# EAGLE design KBV2R5 (EAGLE 5.09)
DIGIKEY#: PS1240P02CT3; MOUSER#: 81-GRM426X104K50D; NEWARK#: 89H0684

## Sheet 1 of 2
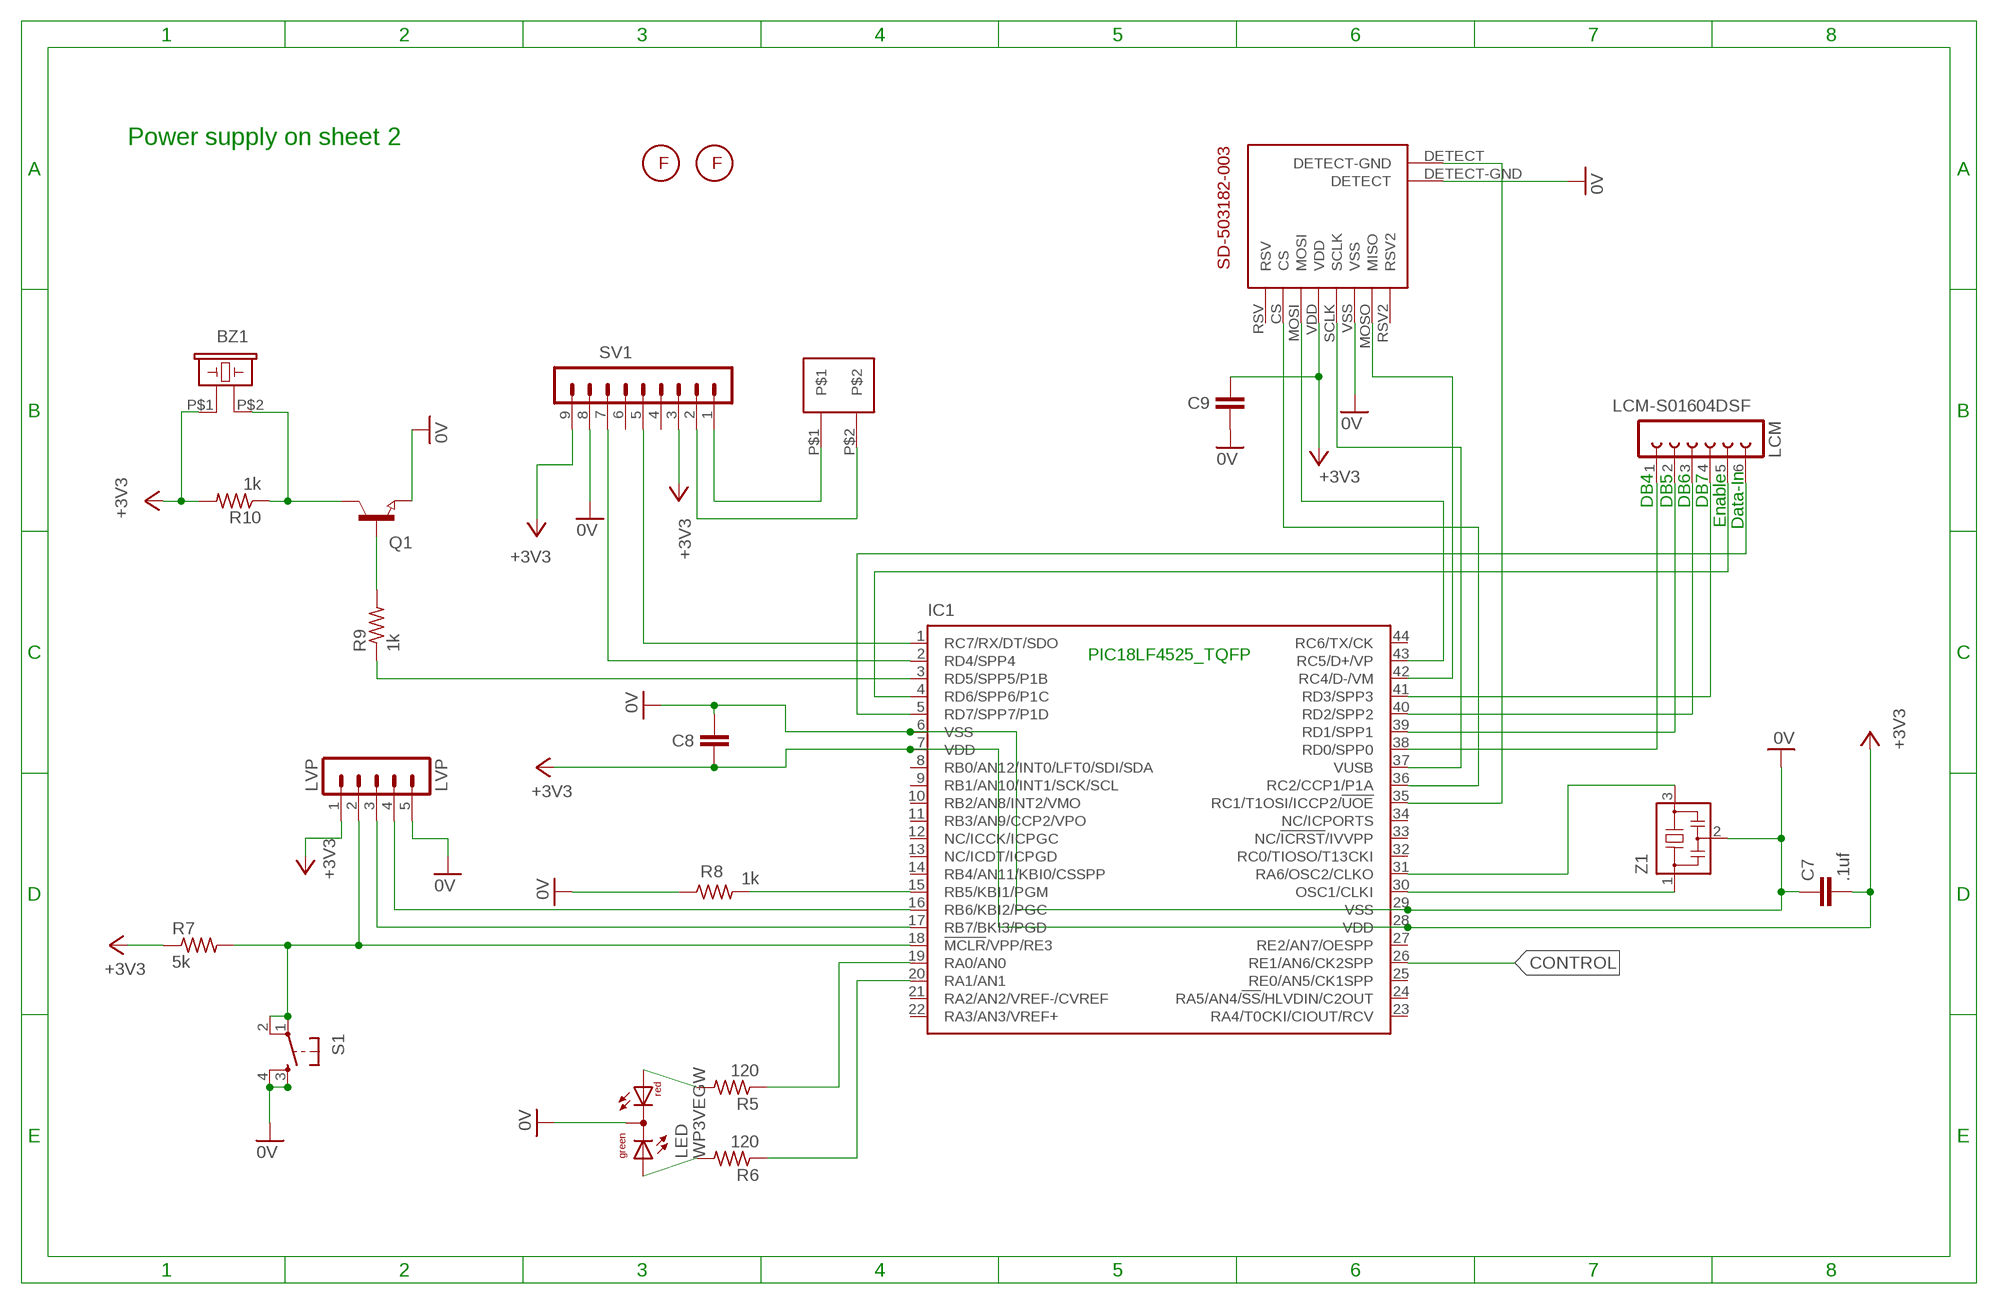
[diagram p0: schematic, sheet 1]

### Parts
BZ1  PS1240P02CT3  HP1360A  [HP1360A]
C7  .1uf  C-EUC1206  [C1206]
C8  .1 uf  C-EUC1206  [C1206]
C9  .1uf  C-EUC1206  [C1206]
FM1  FIDUCIAL2MMCIRCLE  [FIDUCIAL_2MMCIRCLE]
FM2  FIDUCIAL2MMCIRCLE  [FIDUCIAL_2MMCIRCLE]
IC1  PIC18F4525_TQFP Newark 89H0684  PIC18F4550_TQFP  [TQFP44]
LCM  LCM-S01604DSF  FE06-1  [FE06]
LED  WP3VEGW  [DUOLED-A-3MM]
LVP  LVP  MA05-1  [MA05-1]
P1  RC1  2PINPAD  [2PINPAD]
Q1  NPN-TRANSISTOR_SOT23  [SOT23]
R5  120  R-US_R0805W  [R0805W]
R6  120  R-US_R0805W  [R0805W]
R7  5k  R-US_R0805W  [R0805W]
R8  1k  R-US_R0805W  [R0805W]
R9  1k  R-US_R0805W  [R0805W]
R10  1k  R-US_R0805W  [R0805W]
S1  DTS-6  [DTS-6]
SD1  SD-503182-003R  [SD-503182-003]
SV1  MA09-1  [MA09-1]
Z1  CSTCR4M00G53-R0  CSTCR6M00G53Z  [CSTCR6M]

### Nets
0V [GND]: C7.1 C8.1 C9.2 IC1.6(VSS) IC1.29(VSS) LED.2(C) LVP.5 Q1.2(E) R8.1 S1.3 S1.4 SD1.DETECT-GND(DETECT) SD1.VSS SV1.8 Z1.2 ; also sheet 2
+3V3: BZ1.P$1 C7.2 C8.2 C9.1 IC1.7(VDD) IC1.28(VDD) LVP.1 R7.1 R10.2 SD1.VDD SV1.3 SV1.9 ; also sheet 2
CONTROL: IC1.26(RE1/AN6/CK2SPP) ; also sheet 2
N$1: IC1.5(RD7/SPP7/P1D) LCM.6
N$2: IC1.42(RC4/D-/VM) SD1.MOSO(MISO)
N$3: IC1.30(OSC1/CLKI) Z1.1
N$4: Q1.1(B) R9.2
N$5: P1.P$2 SV1.2
N$6: P1.P$1 SV1.1
N$7: IC1.3(RD5/SPP5/P1B) R9.1
N$8: BZ1.P$2 Q1.3(C) R10.1
N$9: IC1.36(RC2/CCP1/P1A) SD1.CS
N$10: IC1.19(RA0/AN0) R5.1
N$11: IC1.20(RA1/AN1) R6.1
N$12: IC1.37(VUSB) SD1.SCLK
N$14: IC1.15(RB5/KBI1/PGM) R8.2
N$15: IC1.17(RB7/BKI3/PGD) LVP.3
N$17: IC1.18(!MCLR!/VPP/RE3) LVP.2 R7.2 S1.1 S1.2
N$18: IC1.16(RB6/KBI2/PGC) LVP.4
N$19: IC1.31(RA6/OSC2/CLKO) Z1.3
N$20: IC1.1(RC7/RX/DT/SDO) SV1.5
N$21: IC1.2(RD4/SPP4) SV1.7
N$24: LED.3(AG) R6.2
N$25: LED.1(AR) R5.2
N$26: IC1.35(RC1/T1OSI/ICCP2/!UOE) SD1.DETECT(DETECT-GND)
N$29: IC1.43(RC5/D+/VP) SD1.MOSI
N$30: IC1.4(RD6/SPP6/P1C) LCM.5
N$31: IC1.38(RD0/SPP0) LCM.1
N$32: IC1.39(RD1/SPP1) LCM.2
N$33: IC1.40(RD2/SPP2) LCM.3
N$34: IC1.41(RD3/SPP3) LCM.4
Unconnected: IC1.8(RB0/AN12/INT0/LFT0/SDI/SDA) IC1.9(RB1/AN10/INT1/SCK/SCL) IC1.10(RB2/AN8/INT2/VMO) IC1.11(RB3/AN9/CCP2/VPO) IC1.12(NC/ICCK/ICPGC) IC1.13(NC/ICDT/ICPGD) IC1.14(RB4/AN11/KBI0/CSSPP) IC1.21(RA2/AN2/VREF-/CVREF) IC1.22(RA3/AN3/VREF+) IC1.23(RA4/T0CKI/CIOUT/RCV) IC1.24(RA5/AN4/!SS!/HLVDIN/C2OUT) IC1.25(RE0/AN5/CK1SPP) IC1.27(RE2/AN7/OESPP) IC1.32(RC0/TIOSO/T13CKI) IC1.33(NC/!ICRST!/IVVPP) IC1.34(NC/ICPORTS) IC1.44(RC6/TX/CK) SD1.RSV SD1.RSV2 SV1.4 SV1.6

### Notes on the sheet
- Power supply on sheet 2
- DB4 | DB5 | DB6 | DB7
- Enable | Data-In
- PIC18LF4525_TQFP

## Sheet 2 of 2
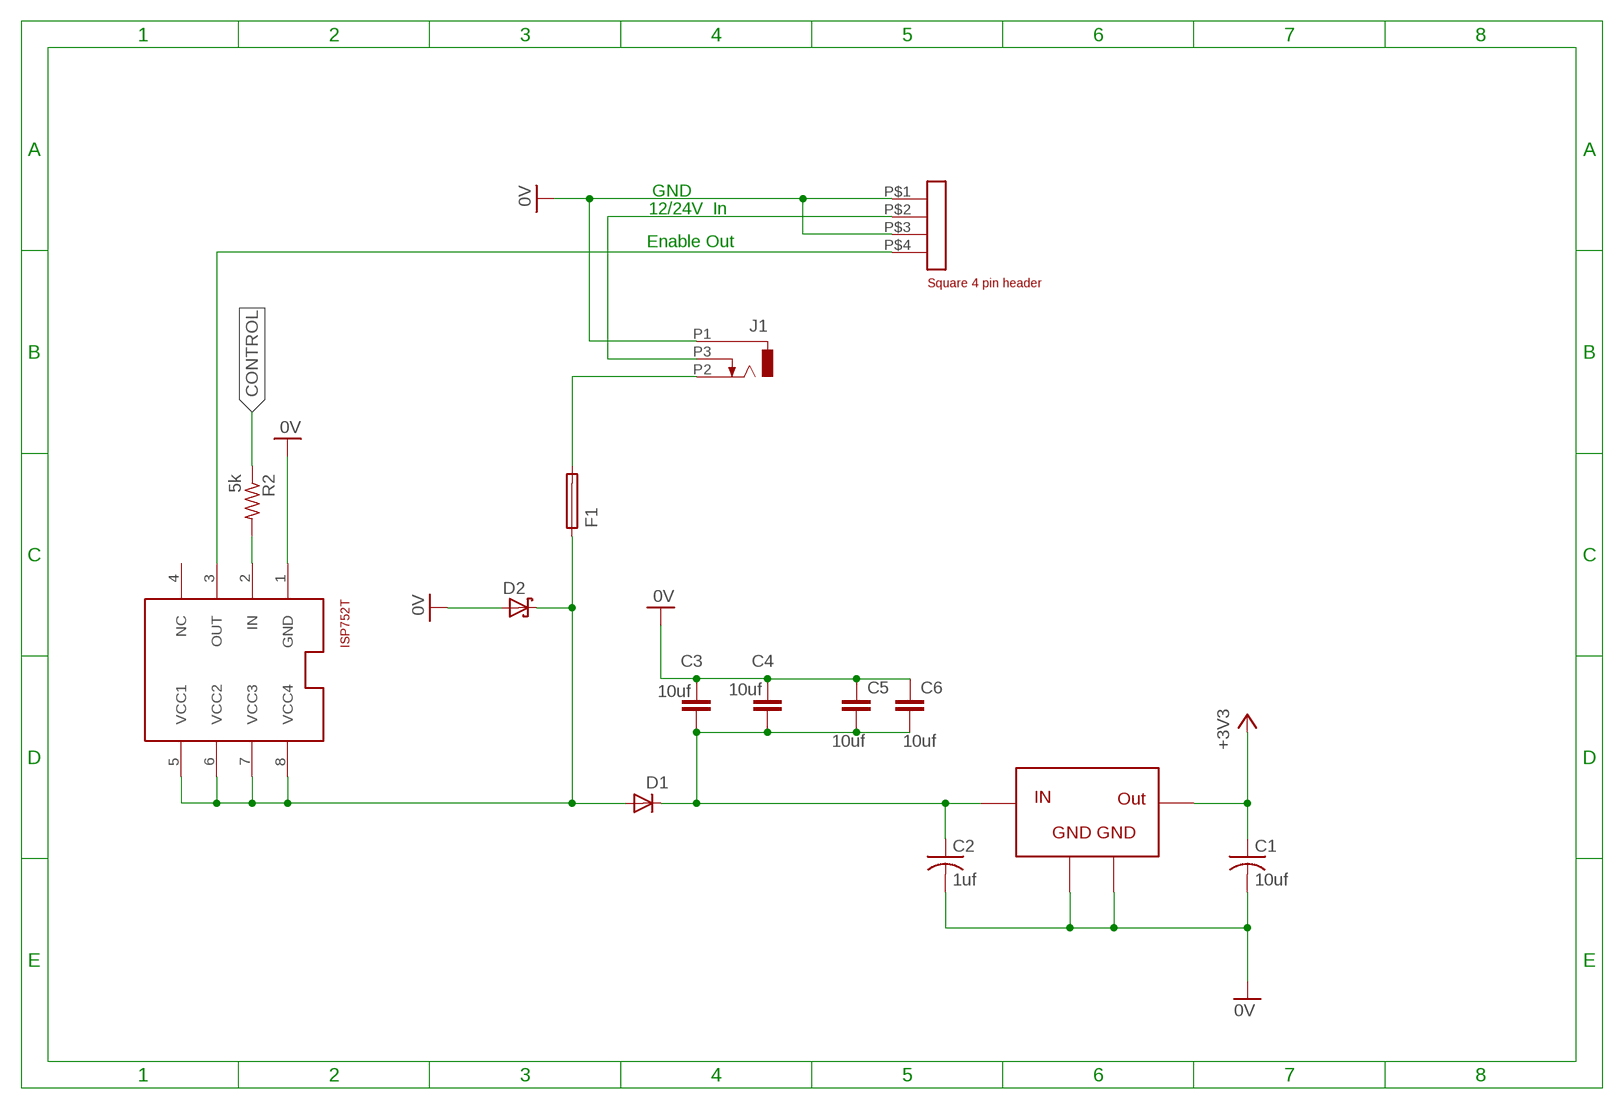
[diagram p1: schematic, sheet 2]

### Parts
C1  10uf  C-USC1210  [C1210]
C2  1uf  C-USC1206  [C1206]
C3  10uf  CAP_CKG57NX5R1H226M  [CKG57]
C4  10uf  CAP_CKG57NX5R1H226M  [CKG57]
C5  10uf  C-EUC1210  [C1210]
C6  10uf  C-EUC1210  [C1210]
D1  M 522-ZHCS400TA  DIODE-SOD323-W  [SOD323-W]
D2  M 863-1SMC28AT3G  SCHOTTKY-DIODESMD  [SMB]
F1  60R090X  72R090X  [LITTLEFUSE]
J1  CP1-022PJCT-ND  [CP1-022PJCT-ND]
J2  MOUSER538-43045-0424  MOUSER538-43045-0224  [MOUSER538-43045-0224]
R2  5k  R-US_R0805W  [R0805W]
SW1  ISP752T  [SO8]
VR1  NCV4274  [NCV4274]

### Nets
0V [GND]: C1.2 C2.2 C3.P$1 C4.P$1 C5.1 C6.1 D2.A J1.P1 J2.P$1 J2.P$3 SW1.1(GND) VR1.P$2 VR1.P$4 ; also sheet 1
+3V3: C1.1 VR1.P$3 ; also sheet 1
CONTROL: R2.1 ; also sheet 1
N$13: R2.2 SW1.2(IN)
N$16: J2.P$4 SW1.3(OUT)
N$22: J1.P3 J2.P$2
N$23: F1.2 J1.P2
N$27: C2.1 C3.P$2 C4.P$2 C5.2 C6.2 D1.C VR1.P$1
N$28: D1.A D2.C F1.1 SW1.5(VCC1) SW1.6(VCC2) SW1.7(VCC3) SW1.8(VCC4)
Unconnected: SW1.4(NC)

### Notes on the sheet
- GND
- 12/24V  In
- Enable Out

## Library data of the parts
BZ1 = buzzer:HP1360A: HP1360A Piezo Buzzer
C1 C2 = rcl:C-US: CAPACITOR, American symbol
C3 C4 = capacitor-wima:CAP_CKG57NX5R1H226M: Multilayer Ceramic Capacitors (MLCC)
C5 C6 = rcl:C-EU: CAPACITOR, European symbol
C7-C9 = resistor:C-EU: CAPACITOR, European symbol
D1 = diode:DIODE-: DIODE
D2 = diode:SCHOTTKY-DIODE: Schottky Diode
F1 = fuse:72R090X: Newark 33P9991 Resettable Fuse .8 amp holding 1.8 amp trip
FM1 FM2 = pickplace:FIDUCIAL: Fiducial marks
IC1 = microchip:PIC18F4*_TQFP: USB Microcontrollers with nanoWatt Technology High-Performance, Enhanced Flash, 28/40/44-Pin, Source: http://ww1.microchip.com/downloads/en/devicedoc/39632c.pdf
J1 = con-jack:CP1-022PJCT-ND: Digikey SMT right angle power jack P1-022PJCT-ND
J2 = Keybuster:MOUSER538-43045-0224: Mouser 2 row 4pin header (2x2)
LCM = con-lsta:FE06-1: FEMALE HEADER
LED = led:WP3VEGW: Red-Green dual LED
LVP = con-lstb:MA05-1: PIN HEADER
P1 = Misc:2PINPAD
Q1 = semicon-smd-ipc:NPN-TRANSISTOR_: NPN TRANSISTOR
R2 R5-R7 R9 R10 = rcl:R-US_: RESISTOR, American symbol
R8 = resistor:R-US_: RESISTOR, American symbol
S1 = switch-tact:DTS-6
SD1 = MolexSD:SD-503182-003R: Molex Micro-SD card socket
SV1 = con-lstb:MA09-1: PIN HEADER
SW1 = zetex:ISP752T: High side switch
VR1 = Keybuster:NCV4274: Precision micro-power voltage regulator
Z1 = murata-filter:CSTCR: Resonator Source: murata.co.jp

## Net classes
0 default: width 0.203 mm
1 GND: width 0.635 mm

## Board
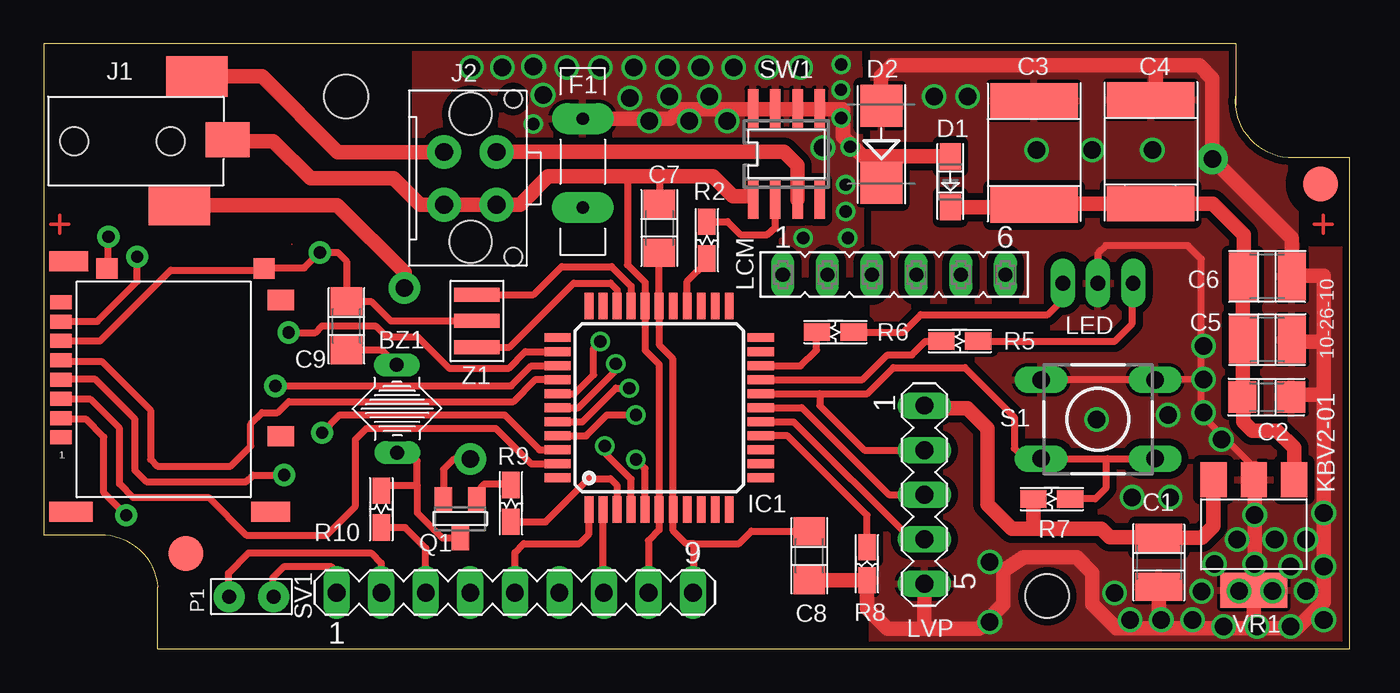
[diagram p2: board, top side]
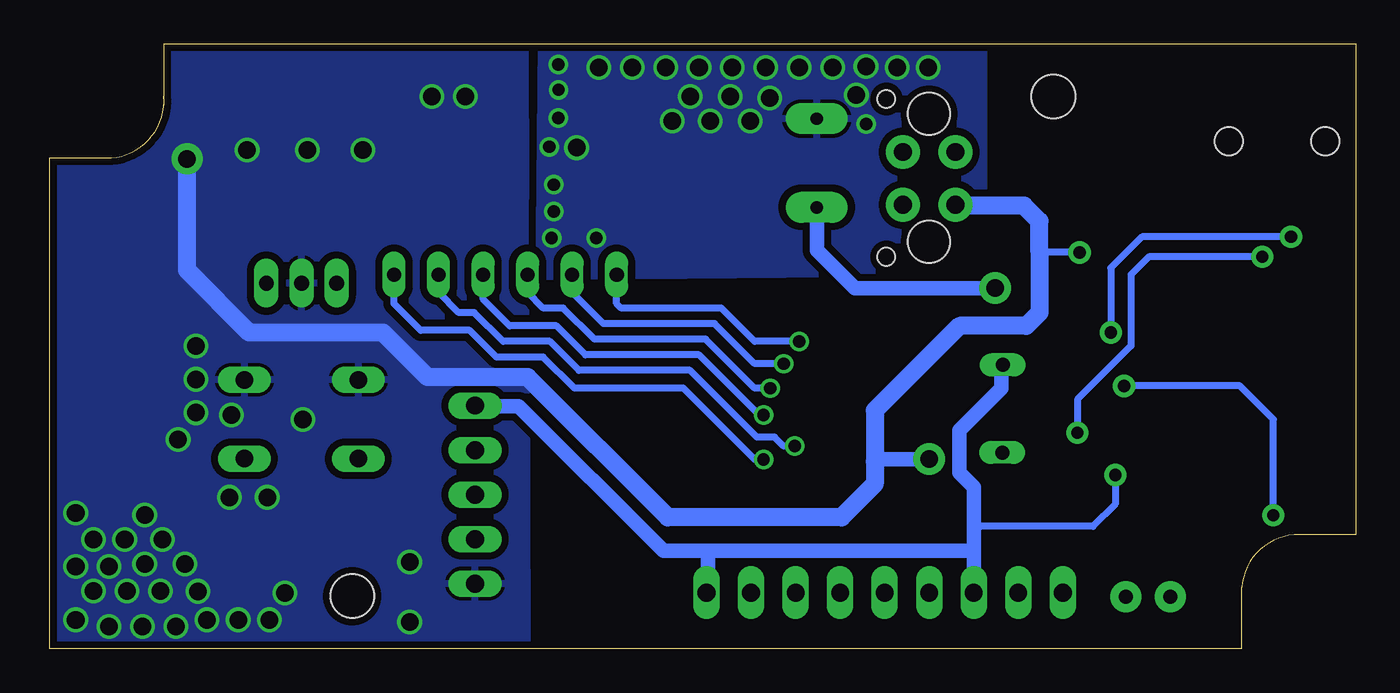
[diagram p3: board, bottom side, seen from below]

Size 74.5 x 34.5 mm. Coordinates in mm from the lower left corner, seen from the top.
Copper layers (1*16): Top 0.035mm / dielectric 1.5mm / Bottom 0.035mm
Design rules "default *": minimum track width 12mil, minimum drill 24mil, track to track 8mil, track to pad 8mil, pad to pad 8mil, via to via 8mil, smd to smd 8mil, copper to edge 8mil, drill to drill 8mil, minimum pad ring 10mil, minimum via ring 8mil, stop-mask expansion 4mil, vias tented up to drill 0mil, thermal gap 8mil
tRestrict: area 72,23.4 to 73.9,25

### Footprints (pad centres in the part's own frame; a part is rotated, then mirrored left to right if it is on the bottom)
HP1360A = drill 0.8 long: P$1 -2.5,0; P$2 2.5,0
C1210 = smd 1.6 x 2.7: 1 -1.4,0; 2 1.4,0
C1206 = smd 1.6 x 1.8: 1 -1.4,0; 2 1.4,0
CKG57 = smd 2 x 5: P$1 1,-2.5; P$2 6.95,-2.5
SOD323-W = smd 1.5 x 1.2: A 1.45,0; C -1.45,0
SMB = smd 2.4 x 2.4: A 2.2,0; C -2.2,0
LITTLEFUSE = drill 0.7 pad 1.778 long: 1 -5.056,0; 2 0.004,0
FIDUCIAL_2MMCIRCLE = smd 2 x 2: P$1 0,0
TQFP44 = smd 1.5 x 0.5: 1 -5.8,4; 2 -5.8,3.2; 3 -5.8,2.4; 4 -5.8,1.6; 5 -5.8,0.8; 6 -5.8,0; 7 -5.8,-0.8; 8 -5.8,-1.6; 9 -5.8,-2.4; 10 -5.8,-3.2; 11 -5.8,-4; 23 5.8,-4; 24 5.8,-3.2; 25 5.8,-2.4; 26 5.8,-1.6; 27 5.8,-0.8; 28 5.8,0; 29 5.8,0.8; 30 5.8,1.6; 31 5.8,2.4; 32 5.8,3.2; 33 5.8,4 | smd 0.5 x 1.5: 12 -4,-5.8; 13 -3.2,-5.8; 14 -2.4,-5.8; 15 -1.6,-5.8; 16 -0.8,-5.8; 17 0,-5.8; 18 0.8,-5.8; 19 1.6,-5.8; 20 2.4,-5.8; 21 3.2,-5.8; 22 4,-5.8; 34 4,5.8; 35 3.2,5.8; 36 2.4,5.8; 37 1.6,5.8; 38 0.8,5.8; 39 0,5.8; 40 -0.8,5.8; 41 -1.6,5.8; 42 -2.4,5.8; 43 -3.2,5.8; 44 -4,5.8
CP1-022PJCT-ND = smd 2.5 x 2: P1 2.76,4.84 | smd 3.5 x 2.3: P2 0.01,1.11; P3 1.01,8.46 | hole 1.6: -0.49,4.76; -5.99,4.76
MOUSER538-43045-0224 = drill 1.02 pad 1.93 round: P$1 0,0; P$2 -3,0; P$3 0,3; P$4 -3,3 | hole 2.41: 2.13,1.5; -5.17,1.5 | hole 1.02: -6.02,3.94; 2.97,3.94
FE06 = drill 0.813 long: 1 -6.35,0; 2 -3.81,0; 3 -1.27,0; 4 1.27,0; 5 3.81,0; 6 6.35,0
DUOLED-A-3MM = drill 0.85 pad 1.4 long: 1 -2,0; 2 0,0; 3 2,0
MA05-1 = drill 1.016 long: 1 -5.08,0; 2 -2.54,0; 3 0,0; 4 2.54,0; 5 5.08,0
2PINPAD = drill 0.8 pad 1.778 round: P$1 0,0; P$2 2.54,0
SOT23 = smd 1 x 1.4: 1 -0.95,-1.1; 2 0.95,-1.1; 3 0,1.1
R0805W = smd 1.5 x 1: 1 -1.052,0; 2 1.052,0
R0805W' = smd 1.5 x 1: 1 -0.94,0; 2 0.94,0
DTS-6 = drill 1 long: 1 -3.25,2.25; 2 3.25,2.25; 3 -3.25,-2.25; 4 3.25,-2.25
SD-503182-003 = smd 1.24 x 0.8: CS -13.11,5.97; MOSI -13.11,7.07; MOSO -13.11,11.47; RSV -13.11,4.87; RSV2 -13.11,12.57; SCLK -13.11,9.27; VDD -13.11,8.17; VSS -13.11,10.37 | smd 1.25 x 1.16: DETECT -10.48,14.51 | smd 1.2 x 1.16: DETECT-GND -1.52,14.51 | smd 1.5 x 1.15: NC1 -0.55,12.71; NC2 -0.56,4.93 | smd 2.2 x 1.15: NC3 -1.14,0.63; NC5 -12.66,14.91 | smd 2.5 x 1.15: NC4 -12.53,0.63
MA09-1 = drill 1.016 long: 1 -10.16,0; 2 -7.62,0; 3 -5.08,0; 4 -2.54,0; 5 0,0; 6 2.54,0; 7 5.08,0; 8 7.62,0; 9 10.16,0
SO8 = smd 0.6 x 2.2: 1 -1.905,-2.6; 2 -0.635,-2.6; 3 0.635,-2.6; 4 1.905,-2.6; 5 1.905,2.6; 6 0.635,2.6; 7 -0.635,2.6; 8 -1.905,2.6
KBV2 = hole 2.5: 17.25,31.5; 57.25,3
NCV4274 = smd 1.5 x 2: P$1 -2.3,-6.3; P$2 0,-6.3; P$3 2.3,-6.3 | smd 3.8 x 2: P$4 0,-0.02
CSTCR6M = smd 0.8 x 2.6: 1 -1.5,0; 2 0,0; 3 1.5,0

### Placement (x,y rotation side)
BZ1  20.15,13.69 270.3 top
C1  63.61,4.94 270 top
C2  69.77,14.36 0 top
C3  58.99,32.26 270 top
C4  65.65,32.32 270 top
C5  69.8,17.63 180 top
C6  69.8,21.23 180 top
C7  35.12,23.99 270 top
C8  43.68,5.31 90 top
C9  17.27,18.41 90 top
D1  51.73,26.63 90 top
D2  47.78,28.77 90 top
F1  30.75,25.17 270 top
FM1  8.1,5.44 0 top
FM2  72.85,26.52 0 top
IC1  35.11,13.75 90 top
J1  7.72,24.18 0 top
J2  22.84,25.33 270 top
LCM  48.51,21.34 0 top
LED  60.15,20.85 180 top
LVP  50.24,8.79 270 top
P1  13.11,2.97 180 top
Q1  23.76,7.42 180 top
R2  37.83,23.3 90 top
R5  52.26,17.55 0 top
R6  45.16,18.06 0 top
R7  57.51,8.55 0 top
R8  1k  [R0805W']  46.97,4.84 90 top
R9  26.65,8.29 90 top
R10  19.25,7.96 270 top
S1  60.15,13.09 180 top
SD1  14.08,7.18 0 top
SV1  26.87,3.2 0 top
SW1  42.37,28.22 0 top
U$1  [KBV2]  0,0 0 top
U$2  [CROSSHAIR_8MIL]  0.91,24.21 0 top
U$3  [CROSSHAIR_8MIL]  73,24.21 0 top
VR1  69.04,3.33 180 top
Z1  24.71,18.69 270 top

### Tracks (layer width: path | path; a pad name or v marks a point on that pad's centre or on a via)
0V  (via drill 0.7 pad 1.27, 1, 1 pad 1.78)
  Top 0.254: S1.3
  Top 0.305: IC1.6 35.11,7.92 | VR1.P$2 68.91,9.75 | 40.17,25.81 40.27,25.81 SW1.1
  Top 0.406: IC1.29 | IC1.29 34.3,19.58 34.3,20.89 33.29,21.89 33.29,26.88 33.35,26.95 | 34.49,26.95 34.48,26.94 | IC1.29 34.3,17.02 35.1,16.22 IC1.6 | 34.87,26.95 34.86,26.94 | 35.11,7.92 35.11,6.78 34.49,6.17 SV1.8 | C7.1 35.12,26.83 35,26.95 | C2.2 71.2,14.38 | 1,17.53 SD1.VSS 3.2,17.55 7.24,21.59 12.41,21.59 SD1.DETECT-GND | SD1.DETECT-GND 12.33,21.67 | SD1.DETECT-GND 12.58,21.72 14.86,21.72 v15.75,22.61 16.76,22.61 17.27,22.1 C9.2 | SD1.DETECT-GND 12.33,21.46 | 63.35,15.34 S1.4 | Z1.2 19.79,18.69 18.67,19.81 C9.2 | 16.76,19.81 16.64,19.94 17.15,19.94 C9.2 | LED.2 60.15,22.55 60.58,22.99 65.28,22.99 66.04,22.23 66.04,15.37 | 66.04,15.37 66.04,13.34 69.09,10.29 69.09,9.68 VR1.P$2 | 63.35,15.34 S1.3 | 66.04,15.37 63.35,15.34 | Q1.2 22.8,10.23 23.37,10.79 24.31,10.79 v24.33,10.82
  Top 0.813: 40.17,25.81 39.32,25.81 38.18,26.95 35,26.95 34.87,26.95 34.49,26.95 33.35,26.95 28.78,26.95 27.16,25.33 J2.P$3 J2.P$1 | 69.04,1.17 VR1.P$4 69.09,3.4 69.09,10.29 | C2.2 71.17,14.86 71.56,14.48 73.03,14.48 | C4.P$1 63.45,31.62 63.45,33.2 63.37,33.27 | C3.P$1 56.41,31.34 | J1.P1 10.55,28.96 13.08,28.96 15.21,26.82 19.97,26.82 21.46,25.33 J2.P$1 | 73.03,14.48 73.03,2.69 71.53,1.19 71.42,1.17 69.04,1.17 | 73.03,17.5 73.03,14.48 | 73.03,17.5 73.03,21.26 71.22,21.26 C6.1 | C5.1 71.33,17.5 73.03,17.5 | C6.1 71.12,21.31 | 69.04,1.17 63.75,1.17 | C1.2 63.61,1.31 63.75,1.17 | J2.P$1 | LVP.5 50.24,1.19 50.29,1.14 | 50.29,1.14 48.13,1.14 46.97,2.31 R8.1 C8.1 | 50.29,1.14 53.34,1.14 54.74,2.54 54.74,4.45 55.88,5.21 58.93,5.21 59.82,4.32 59.82,2.54 61.19,1.17 63.75,1.17 | 63.37,33.27 48.39,33.27 47.75,32.64 47.75,31 D2.A | C6.1 71.2,23.42 v66.67,27.94 66.67,32.51 65.91,33.27 63.37,33.27
  Bottom 0.406: v24.33,10.82 24.26,10.9 | v15.75,22.61 18.03,22.61
  Bottom 0.813: 24.38,10.87 v24.33,10.82 27.28,10.82 27.3,10.79 | 22.78,25.27 J2.P$1
  Bottom 1.016: 22.78,25.27 18.92,25.27 18.03,24.38 18.03,22.61 18.03,19.18 18.8,18.41 22.61,18.41 27.43,13.59 27.43,10.67 | v66.67,27.94 66.67,21.59 63.12,18.03 55.5,18.03 52.96,15.49 47.24,15.49 39.24,7.49 29.34,7.49 27.43,9.4 27.43,10.67 | 27.43,10.67 27.3,10.79
  other vias: 61.09,3.17 67.31,1.27 66.8,4.83 61.98,1.65 73.03,1.65 64.14,13.34 73.03,4.7 67.18,11.94 66.17,15.37 69.22,1.27 62.1,8.64 64.26,8.64 69.09,7.62 72.01,6.22 68.07,6.22 69.09,4.83 70.23,6.22 71.12,4.7 72.01,3.3 71.12,1.27 70.1,3.3 68.2,3.3 65.53,1.65 63.75,1.65 66.05,3.28 66.17,17.27 66.17,13.46 73.03,7.75 63.25,28.45 59.82,28.45 56.64,28.45 52.7,31.5 53.98,4.95 53.98,1.52 50.8,31.5 60.07,13.08
  pour Bottom (isolate 0.406, rank 4): 47.37,34.54 74.6,34.58 74.3,0.13 47.24,0.25
  pour Top (isolate 0.406, rank 4): 47.26,0.25 74.17,0.2 74.63,34.59 47.32,34.53
+3V3  (via drill 0.7 pad 1.27)
  Top 0.305: IC1.7 | 35.1,22.58 C7.2
  Top 0.406: IC1.7 35.89,7.96 35.89,16.54 35.13,17.3 35.13,19.52 IC1.28 35.1,22.58 | LVP.1 50.23,13.88 | R10.2 20.62,6.91 21.79,5.74 SV1.3 | IC1.7 35.89,7.93 | 63.6,6.35 C1.1 63.63,6.33 | 13.59,9.91 13.72,10.03 v13.72,9.91 11.94,9.91 11.56,9.53 5.84,9.53 5.21,10.16 5.21,13.08 2.92,15.37 0.98,15.37 SD1.VDD | C9.1 19.31,17.02 BZ1.P$1 | 37.08,5.99 36.65,5.99 35.91,6.74 IC1.7 | 37.08,5.99 39.65,5.99 40.36,6.71 C8.2 | SV1.9 37.08,3.25 37.08,5.99
  Top 0.508: LVP.1 50.25,13.88
  Top 0.813: VR1.P$3 66.74,7 66.24,6.5 66.23,6.5 66.06,6.33 63.63,6.33 62.47,6.33 | C1.1 63.6,6.35 60.83,6.35 60.33,6.86 56.52,6.86 | 56.52,6.86 55.24,6.86 53.85,8.26 53.85,12.57 52.7,13.72 50.39,13.72 LVP.1 | R7.1 56.45,6.92 56.52,6.86
  Bottom 0.406: v13.72,9.91 13.72,8.26 14.99,6.99 21.41,6.99 21.79,6.6
  Bottom 0.813: 21.79,5.59 SV1.3 | LVP.1 50.22,13.84 47.75,13.84 39.5,5.59 36.96,5.59 | 21.79,5.59 36.96,5.59 | SV1.9 36.96,3.28 36.96,5.59 | 21.79,5.59 21.79,6.6 21.79,9.22 22.61,10.03 22.61,12.46 20.21,14.86 20.21,16.12 BZ1.P$1
CONTROL
  Top 0.305: IC1.26
  Top 0.406: R2.1 37.83,22.08 36.7,20.95 IC1.26
N$1  (via drill 0.7)
  Top 0.406: IC1.5 34.3,10.27 v33.78,10.79
  Bottom 0.406: v33.78,10.79 34.29,10.79 38.35,14.86 44.58,14.86 46.35,16.64 49.02,16.64 50.55,18.16 53.34,18.16 54.86,19.68 LCM.6
N$2  (via drill 0.7 pad 1.27)
  Top 0.406: SD1.MOSO 0.99,18.67 3.05,18.67 5.33,20.95 v5.33,22.35 5.33,22.48 | IC1.42 28.28,11.35 26.29,13.34 16.89,13.34 v15.88,12.32
  Bottom 0.406: v5.33,22.35 11.81,22.35 12.83,21.34 12.83,17.27 15.88,14.22 v15.88,12.32
N$3
  Top 0.305: IC1.30
  Top 0.406: IC1.30 33.5,20.69 32.4,21.79 29.54,21.79 27.94,20.19 Z1.1
N$4
  Top 0.406: Q1.1 24.71,8.96 25.15,9.4 26.6,9.4 R9.2
N$5
  Top 0.406: SV1.2 19.25,4.88 18.67,5.46 11.68,5.46 10.54,4.32 10.54,3 P1.P$2
N$6
  Top 0.406: P1.P$1 13.08,2.97 13.08,4.06 13.72,4.7 16.38,4.7 16.76,4.32 16.76,3.25 SV1.1
N$7
  Top 0.406: 32.7,7.96 IC1.3 32.69,7.96 32.69,9.34 32.32,9.7 31.09,9.7 28.63,7.24 R9.1
N$8
  Top 0.406: Q1.3 22.73,6.33 21.31,7.75 21.31,9.32 | R10.1 19.56,9.32 21.31,9.32 | 21.31,9.32 21.31,10.7 20.83,11.18 20.18,11.18 BZ1.P$2
N$9  (via drill 0.7 pad 1.27)
  Top 0.406: IC1.36 29.29,16.13 27.81,16.13 26.67,14.99 v13.21,14.99 | SD1.CS 1.04,13.08 2.41,13.08 3.43,12.06 3.43,8.89 v4.7,7.62
  Bottom 0.406: v4.7,7.62 4.7,13.08 6.6,14.99 v13.21,14.99
N$10
  Top 0.406: IC1.19 46.72,15.35 48.13,16.76 49.53,16.76 50.29,17.53 51.18,17.53 R5.1
N$11
  Top 0.406: R6.1 44.08,18.03 44.08,17.03 43.18,16.13 40.92,16.13 IC1.20
N$12
  Top 0.406: 29.28,15.34 29.3,15.35 IC1.37 29.28,15.37 28.07,15.37 26.8,14.1 13.97,14.1 13.34,13.46 12.45,13.46 11.81,12.83 11.81,11.56 10.67,10.41 6.48,10.41 6.1,10.79 6.1,13.59 3.3,16.38 1.04,16.38 SD1.SCLK
N$13
  Top 0.406: R2.2 39.02,24.36 39.75,23.62 41.27,23.62 41.73,24 SW1.2
N$14
  Top 0.406: IC1.15 42.44,12.15 46.97,7.62 R8.2
N$15
  Top 0.406: IC1.17 43.25,13.75 48.21,8.79 LVP.3
N$16
  Top 0.813: J2.P$4 26.24,28.35 42.24,28.35 43,27.58 SW1.3
N$17
  Top 0.406: IC1.18 44.27,14.55 | 44.27,14.55 46.98,14.55 48.46,16.03 52.55,16.03 55.37,13.21 55.37,11.43 56.01,10.79 56.85,10.79 S1.2 60.71,10.84 | LVP.2 46.81,11.33 44.27,13.87 44.27,14.55 | 60.71,10.84 S1.1 | R7.2 59.98,8.55 60.58,9.14 60.58,10.71 60.71,10.84
N$18
  Top 0.406: IC1.16 42.78,12.95 49.47,6.26 50.23,6.26 LVP.4
N$19
  Top 0.406: IC1.31 32.72,20.47 32.33,20.85 30.23,20.85 26.57,17.2 Z1.3
N$20
  Top 0.406: IC1.1 31.11,6.54 30.56,5.99 27.38,5.99 26.87,5.49 SV1.5
N$21
  Top 0.305: 31.9,7.9 IC1.2
  Top 0.406: 31.9,7.9 31.9,3.26 SV1.7
N$22
  Top 0.813: J2.P$2 16.75,28.33 12.45,32.64 J1.P3
N$23  (via drill 1 pad 1.78)
  Top 0.813: J1.P2 16.75,25.29 20.57,21.46 v20.57,20.57
  Bottom 0.813: v20.57,20.57 28.57,20.57 30.73,22.73 30.73,25.16 F1.2
N$24
  Top 0.406: 58.15,20.68 LED.3 58.17,20.84 58.17,19.94 57.28,19.05 50.04,19.05 49.05,18.06 R6.2
N$25
  Top 0.406: 62.18,20.82 LED.1 62.1,20.81 62.1,18.54 61.11,17.55 R5.2
N$26  (via drill 0.7 pad 1.27)
  Top 0.254: SD1.DETECT 3.68,21.69 3.68,22.23
  Top 0.406: 3.62,21.72 SD1.DETECT 3.68,21.78 | 29.19,16.95 29.2,16.94 IC1.35 28.92,16.93 27.47,16.94 26.54,16 23.11,16 21.34,17.78 19.56,17.78 18.92,18.41 15.88,18.41 15.49,18.03 v13.97,18.03 | 3.68,22.23 v3.68,23.5
  Bottom 0.406: v3.68,23.5 12.19,23.5 13.97,21.72 v13.97,18.03
N$27
  Top 0.61: 62.74,25.38 62.69,25.43 63.09,25.43 C4.P$2 | C3.P$2 56.55,25.37
  Top 0.813: 56.55,25.37 C4.P$2 | 56.25,25.55 C3.P$2 56.46,25.27 55.37,25.27 55.28,25.18 D1.C | 68.4,20.57 68.4,16.91 68.28,16.79 68.28,16.92 68.4,17.04 C5.2 | 68.4,20.57 C6.2 | C5.2 | C5.2 68.4,14.39 C2.1 68.43,14.36 68.43,12.95 68.94,12.45 70.36,12.45 71.34,11.47 VR1.P$1 71.32,9.64 | 62.74,25.38 66.7,25.38 68.45,23.62 68.45,20.63 68.4,20.57
N$28  (via drill 0.7 pad 0.61, 1)  (1 unrouted)
  Top 0.305: v34.54,30.1 35.56,30.48 35.56,30.23 | 36.83,30.76 36.83,30.48 | 45.59,29.21 45.72,29.21
  Top 0.406: 47.78,28.05 47.88,28.05 47.88,27.69 | D2.C 47.88,26.57 47.88,26.16
  Top 0.813: F1.1 35.56,30.23 35.74,30.23 36.4,30.76 36.83,30.76 45.59,30.76 45.59,29.21 46.72,28.08 47.75,28.08 | 47.75,28.08 D1.A | D2.C 47.78,28.05 47.75,28.08
  other vias: 33.43,31.42 35.69,31.5 36.83,30.1 37.97,31.5 44.45,28.57 38.99,30.1 35.56,33.15 37.47,33.15 39.37,33.15 41.27,33.15 43.18,33.15 33.66,33.15 31.75,33.15 29.84,33.15 28.49,31.57 27.94,33.2 26.16,33.15 24.38,33.15 27.93,29.93 45.49,33.32 45.48,31.88 45.49,30.28 46,28.63 45.75,26.47 45.75,24.94 45.87,23.42 43.33,23.42
  pour Bottom (isolate 0.406, rank 2): 21.21,34.54 46.48,34.54 46.61,21.21 21.21,21.46
  pour Top (isolate 0.406): 21.21,34.54 46.48,34.54 46.61,21.34 21.21,21.46
N$29
  Top 0.406: SD1.MOSI 1,14.22 2.67,14.22 4.32,12.57 4.32,9.4 5.08,8.64 9.4,8.64 11.56,6.48 16.13,6.48 17.78,8.13 17.78,11.94 18.41,12.57 25.78,12.57 27.81,10.55 IC1.43
N$30  (via drill 0.7)
  Top 0.406: IC1.4 33.51,9.68 32,11.18 v32,11.56
  Bottom 0.406: LCM.5 52.32,20.32 51.18,19.18 50.29,19.18 48.64,17.53 45.97,17.53 44.32,15.88 37.97,15.88 34.16,12.06 33.15,12.06 32.64,11.56 v32,11.56
N$31  (via drill 0.7)
  Top 0.406: IC1.38 30.29,14.55 31.37,15.62 31.37,17.14 v31.75,17.53
  Bottom 0.406: LCM.1 42.16,19.68 41.91,19.43 36.2,19.43 34.29,17.53 v31.75,17.53
N$32  (via drill 0.7)
  Top 0.406: IC1.39 30.51,13.75 32.51,15.75 32.51,16.13 v32.64,16.26
  Bottom 0.406: 44.69,21.32 LCM.2 44.7,20.32 42.93,18.54 36.58,18.54 34.29,16.26 v32.64,16.26
N$33  (via drill 0.7)
  Top 0.406: IC1.40 30.73,12.95 32.64,14.86 v33.4,14.86
  Bottom 0.406: v33.4,14.86 34.29,14.86 37.08,17.65 43.43,17.65 45.21,19.43 46.35,19.43 47.24,20.32 LCM.3
N$34  (via drill 0.7)
  Top 0.406: IC1.41 30.94,12.15 32.13,13.34 v33.78,13.34
  Bottom 0.406: v33.78,13.34 34.04,13.34 37.47,16.76 43.94,16.76 45.59,18.41 48.26,18.41 49.78,19.94 LCM.4

### Text on the board
tPlace: 10-26-10 | P1
tNames: KBV2-01
Reference: Encolsure